# Altium schematic sheet Top_Level_BD.SchDoc: Top Level Block Diagram
size 279 x 215 mm; CompanyName: Flat Earth Inc.; DrawnBy: Connor Dack; Engineer: Connor Dack; Address1: 985 Technology Blvd; Address2: Suite 102; Address3: Bozeman, MT, 59718; DocumentNumber: 4; Revision: 0.0; SheetNumber: 4; SheetTotal: 8
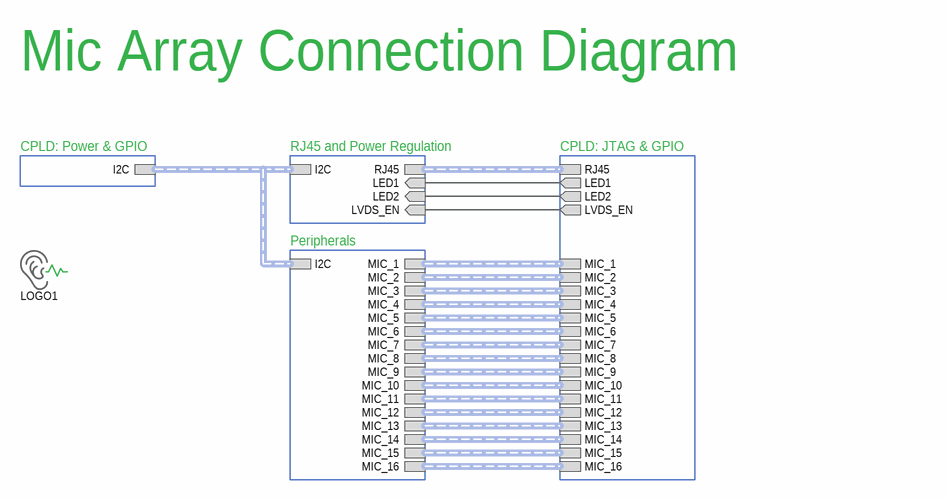
[diagram p0: Top_Level_BD.SchDoc]

## Parts
LOGO1  Audio Logic Logo  [AL_Logo_Large_Silkscreen]  (value not drawn)  (no BOM)

## Sub-sheets
CPLD: JTAG & GPIO = CPLD.SchDoc: MIC_1 (harness MIC_1), MIC_2 (harness MIC_2), MIC_3 (harness MIC_3), MIC_4 (harness MIC_4), MIC_5 (harness MIC_5), MIC_6 (harness MIC_6), MIC_7 (harness MIC_7), MIC_8 (harness MIC_8), MIC_9 (harness MIC_9), MIC_10 (harness MIC_10), MIC_11 (harness MIC_11), MIC_12 (harness MIC_12), MIC_13 (harness MIC_13), MIC_14 (harness MIC_14), MIC_15 (harness MIC_15), MIC_16 (harness MIC_16), RJ45 (harness RJ45), LED2 (out), LED1 (out), LVDS_EN (out)
CPLD: Power & GPIO = CPLD_2.SchDoc: I2C (harness I2C)
Peripherals = Peripherals.SchDoc: I2C (harness I2C), MIC_2 (harness MIC_2), MIC_8 (harness MIC_8), MIC_10 (harness MIC_10), MIC_1 (harness MIC_1), MIC_6 (harness MIC_6), MIC_7 (harness MIC_7), MIC_15 (harness MIC_15), MIC_5 (harness MIC_5), MIC_11 (harness MIC_11), MIC_12 (harness MIC_12), MIC_3 (harness MIC_3), MIC_13 (harness MIC_13), MIC_4 (harness MIC_4), MIC_16 (harness MIC_16), MIC_9 (harness MIC_9), MIC_14 (harness MIC_14)
RJ45 and Power Regulation = RJ45_Power_Reg.SchDoc: I2C (harness I2C), LED1 (in), LED2 (in), RJ45 (harness RJ45), LVDS_EN (in)

## Nets
(unnamed): sheet RJ45 and Power Regulation/LED1, sheet CPLD: JTAG & GPIO/LED1
(unnamed): sheet RJ45 and Power Regulation/LED2, sheet CPLD: JTAG & GPIO/LED2
(unnamed): sheet RJ45 and Power Regulation/LVDS_EN, sheet CPLD: JTAG & GPIO/LVDS_EN

## Buses and harness runs
harness sheet CPLD: JTAG & GPIO/MIC_1 = sheet Peripherals/MIC_1
harness sheet CPLD: JTAG & GPIO/MIC_2 = sheet Peripherals/MIC_2
harness sheet CPLD: JTAG & GPIO/MIC_3 = sheet Peripherals/MIC_3
harness sheet CPLD: JTAG & GPIO/MIC_4 = sheet Peripherals/MIC_4
harness sheet CPLD: JTAG & GPIO/MIC_5 = sheet Peripherals/MIC_5
harness sheet CPLD: JTAG & GPIO/MIC_6 = sheet Peripherals/MIC_6
harness sheet CPLD: JTAG & GPIO/MIC_7 = sheet Peripherals/MIC_7
harness sheet CPLD: JTAG & GPIO/MIC_8 = sheet Peripherals/MIC_8
harness sheet CPLD: JTAG & GPIO/MIC_9 = sheet Peripherals/MIC_9
harness sheet CPLD: JTAG & GPIO/MIC_10 = sheet Peripherals/MIC_10
harness sheet CPLD: JTAG & GPIO/MIC_11 = sheet Peripherals/MIC_11
harness sheet CPLD: JTAG & GPIO/MIC_12 = sheet Peripherals/MIC_12
harness sheet CPLD: JTAG & GPIO/MIC_13 = sheet Peripherals/MIC_13
harness sheet CPLD: JTAG & GPIO/MIC_14 = sheet Peripherals/MIC_14
harness sheet CPLD: JTAG & GPIO/MIC_15 = sheet Peripherals/MIC_15
harness sheet CPLD: JTAG & GPIO/MIC_16 = sheet Peripherals/MIC_16
harness sheet CPLD: JTAG & GPIO/RJ45 = sheet RJ45 and Power Regulation/RJ45
harness sheet CPLD: Power & GPIO/I2C = sheet Peripherals/I2C = sheet RJ45 and Power Regulation/I2C

## Notes on the sheet
- Mic Array Connection Diagram
- Title:
- Sheet:
- of
- Size:
- 11 x 8.5 Inches
- Rev:
- Date:
- Engineer:
- Time:
- File:
- Copyright 2020 Audio Logic Inc
  THE HARDWARE IS PROVIDED "AS IS", WITHOUT WARRANTY OF ANY KIND, EXPRESS OR IMPLIED, INCLUDING BUT NOT LIMITED TO THE WARRANTIES OF MERCHANTABILITY, FITNESS FOR A PARTICULAR PURPOSE AND NONINFRINGEMENT. IN NO EVENT SHALL THE AUTHORS OR COPYRIGHT HOLDERS BE LIABLE FOR ANY CLAIM, DAMAGES OR OTHER LIABILITY, WHETHER IN AN ACTION OF CONTRACT, TORT OR OTHERWISE, ARISING FROM, OUT OF OR IN CONNECTION WITH THE HARDWARE OR THE USE OR OTHER DEALINGS IN THE HARDWARE.

## Library data of the parts
LOGO1 = Audio_Logic_Logo